# Altium schematic sheet Main.SchDoc
size A4; SheetNumber: 1; SheetTotal: 4
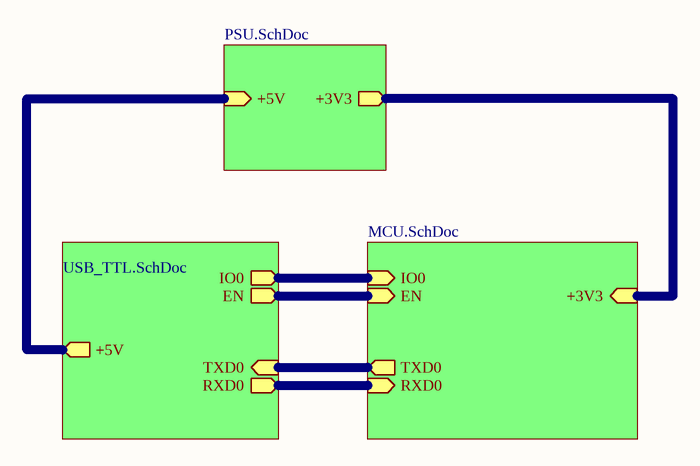
[diagram p0: Main.SchDoc]

## Sub-sheets
Designator = MCU.SchDoc: IO0 (in), EN (in), TXD0 (out), RXD0 (in), +3V3 (in)
Designator = USB_TTL.SchDoc: TXD0 (in), RXD0 (out), +5V (out), IO0 (out), EN (out)
Designator = PSU.SchDoc: +5V (in), +3V3 (out)

## Nets
(unnamed): sheet Designator/IO0, sheet Designator/IO0
(unnamed): sheet Designator/EN, sheet Designator/EN
(unnamed): sheet Designator/TXD0, sheet Designator/TXD0
(unnamed): sheet Designator/RXD0, sheet Designator/RXD0
(unnamed): sheet Designator/+3V3, sheet Designator/+3V3
(unnamed): sheet Designator/+5V, sheet Designator/+5V